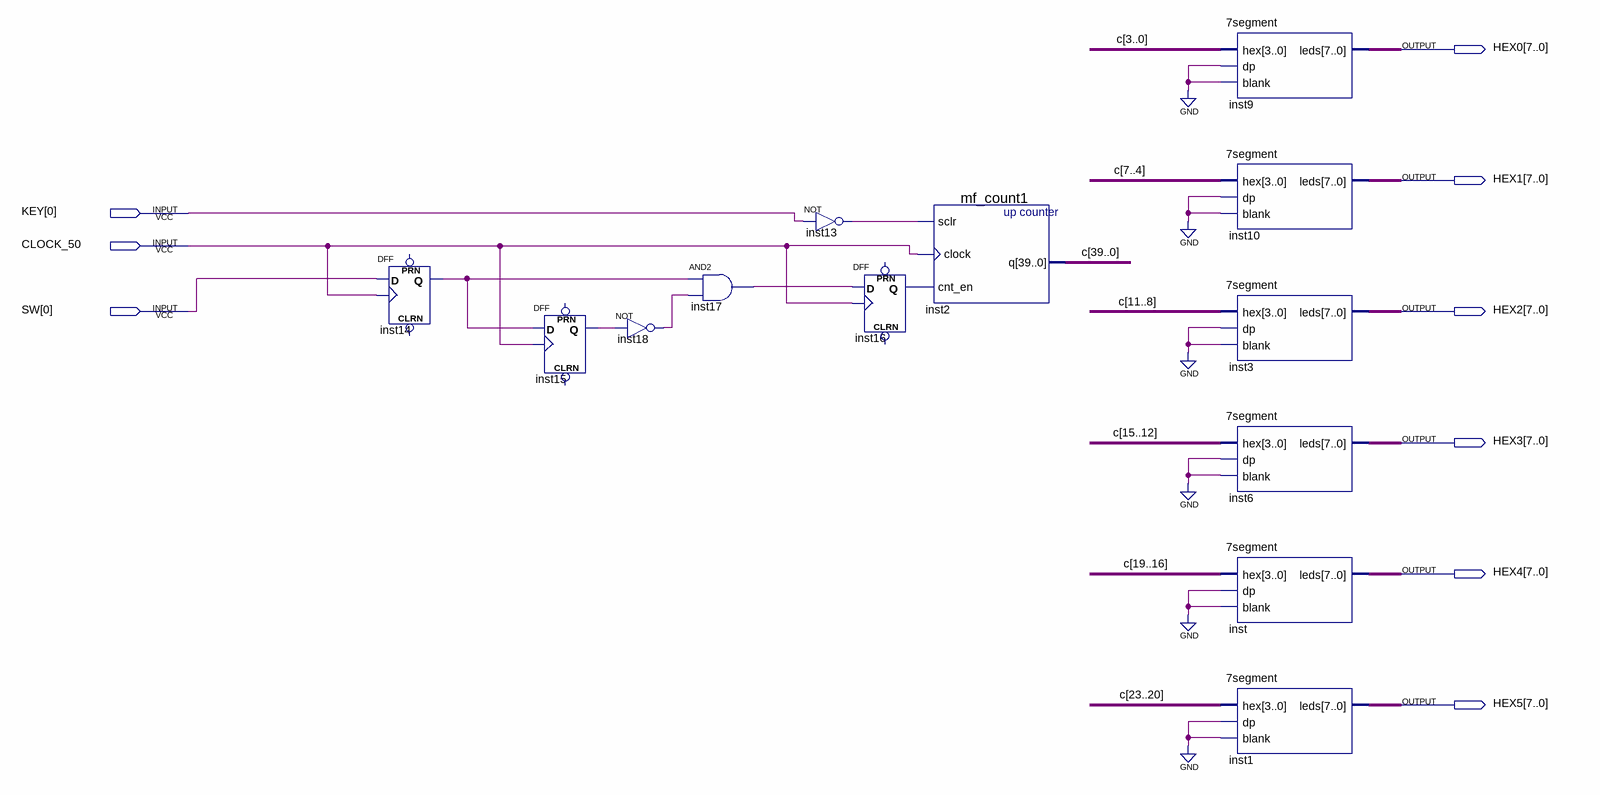
[diagram p0: schematic sheet]
// Quartus schematic Counter.bdf as structural Verilog: 13 symbols, 9 pins
module Counter (
  input  [0:0] KEY,
  input  CLOCK_50,
  input  [0:0] SW,
  output [7:0] HEX0,
  output [7:0] HEX1,
  output [7:0] HEX2,
  output [7:0] HEX3,
  output [7:0] HEX4,
  output [7:0] HEX5
);

  wire inst13_out, inst14_q, inst15_q, inst16_q, inst17_out, inst18_out;
  wire [39:0] c;

  DFF inst14 (.CLK(CLOCK_50), .D(SW[0]), .Q(inst14_q));  // open: CLRN, PRN
  DFF inst15 (.CLK(CLOCK_50), .D(inst14_q), .Q(inst15_q));  // open: CLRN, PRN
  not inst18 (inst18_out, inst15_q);
  and inst17 (inst17_out, inst14_q, inst18_out);
  not inst13 (inst13_out, KEY[0]);
  DFF inst16 (.CLK(CLOCK_50), .D(inst17_out), .Q(inst16_q));  // open: CLRN, PRN
  mf_count1 inst2 (.sclr(inst13_out), .clock(CLOCK_50), .cnt_en(inst16_q), .q(c));
  \7segment  inst9 (.hex(c[3:0]), .dp(1'b0), .blank(1'b0), .leds(HEX0));
  \7segment  inst10 (.hex(c[7:4]), .dp(1'b0), .blank(1'b0), .leds(HEX1));
  \7segment  inst3 (.hex(c[11:8]), .dp(1'b0), .blank(1'b0), .leds(HEX2));
  \7segment  inst6 (.hex(c[15:12]), .dp(1'b0), .blank(1'b0), .leds(HEX3));
  \7segment  inst (.hex(c[19:16]), .dp(1'b0), .blank(1'b0), .leds(HEX4));
  \7segment  inst1 (.hex(c[23:20]), .dp(1'b0), .blank(1'b0), .leds(HEX5));
endmodule
